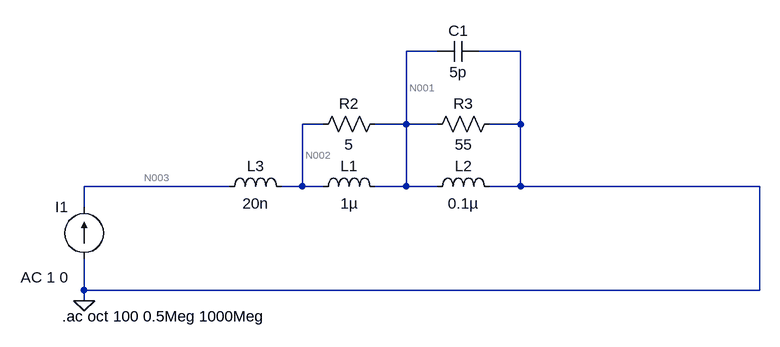
[diagram p0: schematic Draft3.asc]
Draft3.asc, the LTspice schematic file:
Version 4
SHEET 1 920 680
WIRE 352 -48 304 -48
WIRE 480 -48 416 -48
WIRE 176 64 144 64
WIRE 304 64 304 -48
WIRE 304 64 256 64
WIRE 352 64 304 64
WIRE 480 64 480 -48
WIRE 480 64 432 64
WIRE 32 160 -192 160
WIRE 144 160 144 64
WIRE 144 160 112 160
WIRE 176 160 144 160
WIRE 304 160 304 64
WIRE 304 160 256 160
WIRE 352 160 304 160
WIRE 480 160 480 64
WIRE 480 160 432 160
WIRE 848 160 480 160
WIRE -192 192 -192 160
WIRE -192 320 -192 272
WIRE 848 320 848 160
WIRE 848 320 -192 320
WIRE -192 336 -192 320
FLAG -192 336 0
SYMBOL res 272 48 R90
WINDOW 0 0 56 VBottom 2
WINDOW 3 32 56 VTop 2
SYMATTR InstName R2
SYMATTR Value 5
SYMBOL res 448 48 R90
WINDOW 0 0 56 VBottom 2
WINDOW 3 32 56 VTop 2
SYMATTR InstName R3
SYMATTR Value 55
SYMBOL ind 160 176 R270
WINDOW 0 32 56 VTop 2
WINDOW 3 5 56 VBottom 2
SYMATTR InstName L1
SYMATTR Value 1µ
SYMBOL ind 336 176 R270
WINDOW 0 32 56 VTop 2
WINDOW 3 5 56 VBottom 2
SYMATTR InstName L2
SYMATTR Value 0.1µ
SYMBOL ind 16 176 R270
WINDOW 0 32 56 VTop 2
WINDOW 3 5 56 VBottom 2
SYMATTR InstName L3
SYMATTR Value 20n
SYMBOL current -192 272 R180
WINDOW 0 24 80 Left 2
WINDOW 3 24 0 Left 2
WINDOW 123 24 -28 Left 2
WINDOW 39 0 0 Left 0
SYMATTR InstName I1
SYMATTR Value ""
SYMATTR Value2 AC 1 0
SYMBOL cap 416 -64 R90
WINDOW 0 0 32 VBottom 2
WINDOW 3 32 32 VTop 2
SYMATTR InstName C1
SYMATTR Value 5p
TEXT -226 360 Left 2 !.ac oct 100 0.5Meg 1000Meg

The netlist it stands for:
* Draft3.asc
R2 N001 N002 5
R3 0 N001 55
L1 N002 N001 1µ
L2 N001 0 0.1µ
L3 N003 N002 20n
I1 0 N003 AC 1 0
C1 0 N001 5p
.ac oct 100 0.5Meg 1000Meg
.backanno
.end

* Results of the author's LTspice run, read from the files saved beside the schematic
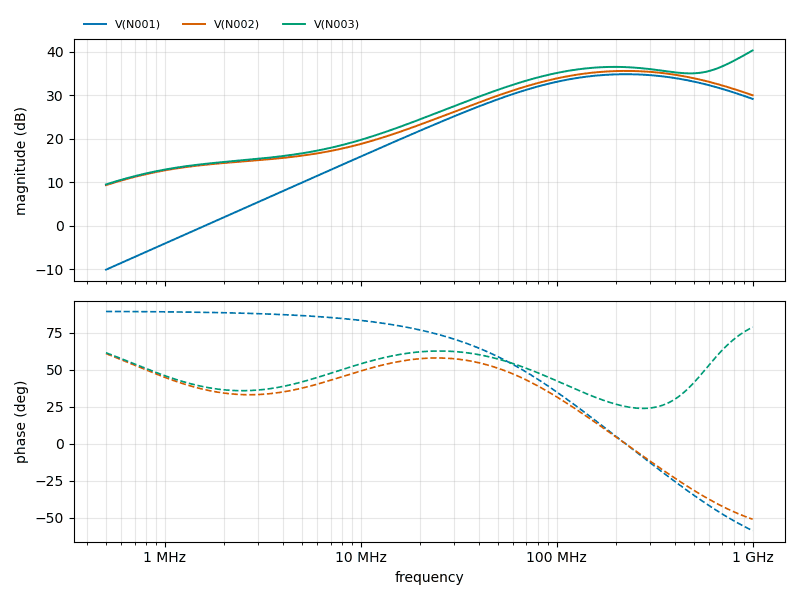
[diagram p1: AC Analysis of Draft3.asc, plotted from the saved traces]
* AC Analysis, 1 run:
*   V(N001): -10.06 dB at 500 kHz, 29.14 dB at 1 GHz, peak 34.81 dB at 224.4 MHz, 3 dB below the peak at 77.23 MHz and 656 MHz
*   V(N002): 9.34 dB at 500 kHz, 29.97 dB at 1 GHz, peak 35.56 dB at 224.4 MHz, 3 dB below the peak at 76.71 MHz and 659.5 MHz
*   V(N003): 9.51 dB at 500 kHz, 40.27 dB at 1 GHz, peak 40.27 dB at 1 GHz, 3 dB below the peak at 752 MHz